# Altium schematic sheet Top.SchDoc
size A4; SheetNumber: 1; SheetTotal: 6
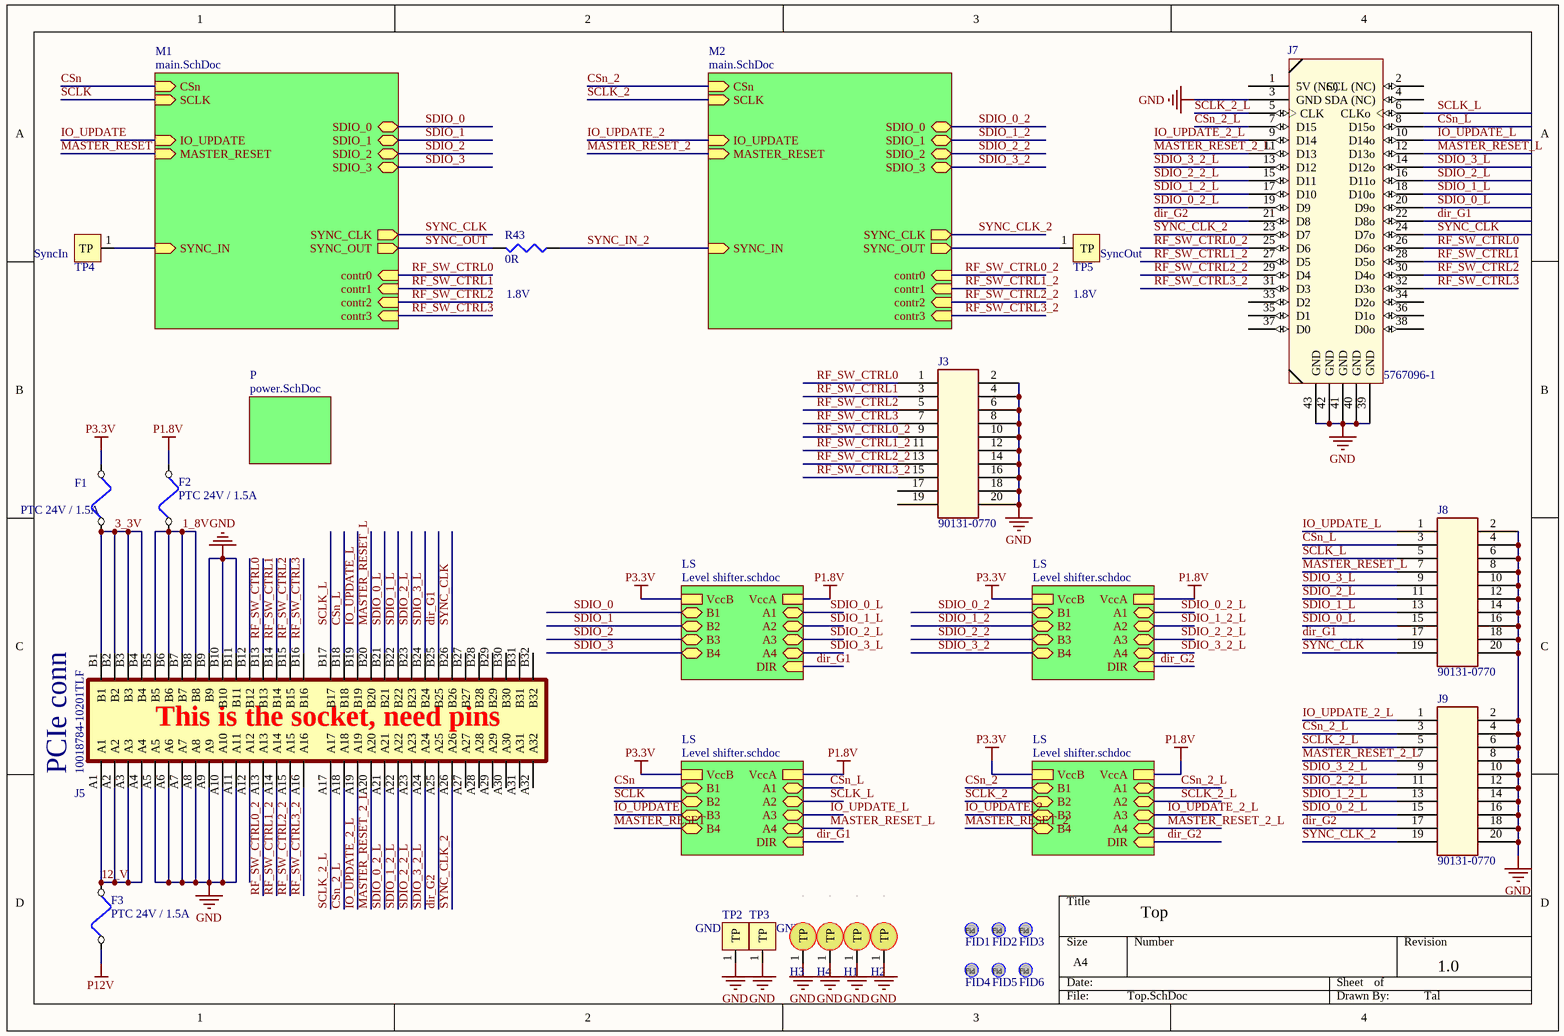
[diagram p0: Top.SchDoc]

## Parts
F1  PTC 24V / 1.5A  [1812_F]
F2  PTC 24V / 1.5A  [1812_F]
F3  PTC 24V / 1.5A  [1812_F]
FID1  Fiducial  [Fiducial]  (value not drawn)
FID2  Fiducial  [Fiducial]  (value not drawn)
FID3  Fiducial  [Fiducial]  (value not drawn)
FID4  Fiducial  [Fiducial]  (value not drawn)
FID5  Fiducial  [Fiducial]  (value not drawn)
FID6  Fiducial  [Fiducial]  (value not drawn)
H1  Hole 3mm  [hole 3mm]  (value not drawn)
H2  Hole 3mm  [hole 3mm]  (value not drawn)
H3  Hole 3mm  [hole 3mm]  (value not drawn)
H4  Hole 3mm  [hole 3mm]  (value not drawn)
J3  90131-0770  [HEADER_10x2]
J5  10018784-10201TLF  [PCIE_8LANE_EDGE]
J7  5767096-1  [MICTOR-38_PIN]
J8  90131-0770  [HEADER_10x2]
J9  90131-0770  [HEADER_10x2]
R43  0R  [R0402]
TP2  GND  [TP_2x1.8]
TP3  GND  [TP_2x1.8]
TP4  SyncIn  [TP_2x1.8]
TP5  SyncOut  [TP_2x1.8]

## Sub-sheets
LS = Level shifter.schdoc: A4 (bidir), B3 (bidir), A2 (bidir), B1 (bidir), B4 (bidir), A1 (bidir), B2 (bidir), A3 (bidir), VccA, VccB, DIR (in)
LS = Level shifter.schdoc: A4 (bidir), B3 (bidir), A2 (bidir), B1 (bidir), B4 (bidir), A1 (bidir), B2 (bidir), A3 (bidir), VccA, VccB, DIR (in)
LS = Level shifter.schdoc: A4 (bidir), B3 (bidir), A2 (bidir), B1 (bidir), B4 (bidir), A1 (bidir), B2 (bidir), A3 (bidir), VccA, VccB, DIR (in)
LS = Level shifter.schdoc: A4 (bidir), B3 (bidir), A2 (bidir), B1 (bidir), B4 (bidir), A1 (bidir), B2 (bidir), A3 (bidir), VccA, VccB, DIR (in)
M1 = main.SchDoc: SYNC_CLK (out), SYNC_OUT (out), SDIO_0 (bidir), SDIO_1 (bidir), SDIO_2 (bidir), SDIO_3 (bidir), CSn (in), IO_UPDATE (in), MASTER_RESET (in), SCLK (in), SYNC_IN (in), contr0 (in), contr1 (in), contr2 (in), contr3 (in)
M2 = main.SchDoc: SYNC_CLK (out), SYNC_OUT (out), SDIO_0 (bidir), SDIO_1 (bidir), SDIO_2 (bidir), SDIO_3 (bidir), CSn (in), IO_UPDATE (in), MASTER_RESET (in), SCLK (in), SYNC_IN (in), contr0 (in), contr1 (in), contr2 (in), contr3 (in)
P = power.SchDoc: no entries

## Nets
GND: H1.1(TP) H2.1(TP) H3.1(TP) H4.1(TP) J3.2 J3.4 J3.6 J3.8 J3.10 J3.12 J3.14 J3.16 J3.18 J3.20 J5.A5 J5.A6 J5.A7 J5.A8 J5.A9 J5.A10 J5.A11 J5.B9 J5.B10 J5.B11 J7.3(GND) J7.39(GND) J7.40(GND) J7.41(GND) J7.42(GND) J7.43(GND) J8.2 J8.4 J8.6 J8.8 J8.10 J8.12 J8.14 J8.16 J8.18 J8.20 J9.2 J9.4 J9.6 J9.8 J9.10 J9.12 J9.14 J9.16 J9.18 J9.20 TP2.1(TP) TP3.1(TP)
P1.8V: F2.2 ; sheet LS/VccA, sheet LS/VccA, sheet LS/VccA, sheet LS/VccA
P3.3V: F1.2 ; sheet LS/VccB, sheet LS/VccB, sheet LS/VccB, sheet LS/VccB
P12V: F3.1
1_8V: F2.1 J5.B5 J5.B6 J5.B7 J5.B8
3_3V: F1.1 J5.B1 J5.B2 J5.B3 J5.B4
12_V: F3.2 J5.A1 J5.A2 J5.A3 J5.A4
CSn: sheet M1/CSn, sheet LS/B1
CSn_2: sheet M2/CSn, sheet LS/B1
CSn_2_L: J5.A18 J7.7(D15) J9.3 ; sheet LS/A1
CSn_L: J5.B18 J7.8(D15o) J8.3 ; sheet LS/A1
dir_G1: J5.B25 J7.22(D8o) J8.17 ; sheet LS/DIR, sheet LS/DIR
dir_G2: J5.A25 J7.21(D8) J9.17 ; sheet LS/DIR, sheet LS/DIR
IO_UPDATE: sheet M1/IO_UPDATE, sheet LS/B3
IO_UPDATE_2: sheet M2/IO_UPDATE, sheet LS/B3
IO_UPDATE_2_L: J5.A19 J7.9(D14) J9.1 ; sheet LS/A3
IO_UPDATE_L: J5.B19 J7.10(D14o) J8.1 ; sheet LS/A3
MASTER_RESET: sheet M1/MASTER_RESET, sheet LS/B4
MASTER_RESET_2: sheet M2/MASTER_RESET, sheet LS/B4
MASTER_RESET_2_L: J5.A20 J7.11(D13) J9.7 ; sheet LS/A4
MASTER_RESET_L: J5.B20 J7.12(D13o) J8.7 ; sheet LS/A4
RF_SW_CTRL0: J3.1 J5.B13 J7.26(D6o) ; sheet M1/contr0
RF_SW_CTRL0_2: J3.9 J5.A13 J7.25(D6) ; sheet M2/contr0
RF_SW_CTRL1: J3.3 J5.B14 J7.28(D5o) ; sheet M1/contr1
RF_SW_CTRL1_2: J3.11 J5.A14 J7.27(D5) ; sheet M2/contr1
RF_SW_CTRL2: J3.5 J5.B15 J7.30(D4o) ; sheet M1/contr2
RF_SW_CTRL2_2: J3.13 J5.A15 J7.29(D4) ; sheet M2/contr2
RF_SW_CTRL3: J3.7 J5.B16 J7.32(D3o) ; sheet M1/contr3
RF_SW_CTRL3_2: J3.15 J5.A16 J7.31(D3) ; sheet M2/contr3
SCLK: sheet M1/SCLK, sheet LS/B2
SCLK_2: sheet M2/SCLK, sheet LS/B2
SCLK_2_L: J5.A17 J7.5(CLK) J9.5 ; sheet LS/A2
SCLK_L: J5.B17 J7.6(CLKo) J8.5 ; sheet LS/A2
SDIO_0: sheet M1/SDIO_0, sheet LS/B1
SDIO_0_2: sheet M2/SDIO_0, sheet LS/B1
SDIO_0_2_L: J5.A21 J7.19(D9) J9.15 ; sheet LS/A1
SDIO_0_L: J5.B21 J7.20(D9o) J8.15 ; sheet LS/A1
SDIO_1: sheet M1/SDIO_1, sheet LS/B2
SDIO_1_2: sheet M2/SDIO_1, sheet LS/B2
SDIO_1_2_L: J5.A22 J7.17(D10) J9.13 ; sheet LS/A2
SDIO_1_L: J5.B22 J7.18(D10o) J8.13 ; sheet LS/A2
SDIO_2: sheet M1/SDIO_2, sheet LS/B3
SDIO_2_2: sheet M2/SDIO_2, sheet LS/B3
SDIO_2_2_L: J5.A23 J7.15(D11) J9.11 ; sheet LS/A3
SDIO_2_L: J5.B23 J7.16(D11o) J8.11 ; sheet LS/A3
SDIO_3: sheet M1/SDIO_3, sheet LS/B4
SDIO_3_2: sheet M2/SDIO_3, sheet LS/B4
SDIO_3_2_L: J5.A24 J7.13(D12) J9.9 ; sheet LS/A4
SDIO_3_L: J5.B24 J7.14(D12o) J8.9 ; sheet LS/A4
SYNC_CLK: J5.B26 J7.24(D7o) J8.19 ; sheet M1/SYNC_CLK
SYNC_CLK_2: J5.A26 J7.23(D7) J9.19 ; sheet M2/SYNC_CLK
SYNC_IN_2: R43.1 ; sheet M2/SYNC_IN
SYNC_OUT: R43.2 ; sheet M1/SYNC_OUT
NetTP4_1: TP4.1(TP) ; sheet M1/SYNC_IN
NetTP5_1: TP5.1(TP) ; sheet M2/SYNC_OUT

Not connected (* = marked no-connect by the designer): J3 17 19; J5 A12 A27 A28 A29 A30 A31 A32 B12 B27 B28 B29 B30 B31 B32; J7 1(5V_(NC)) 2(SCL_(NC)) 4(SDA_(NC)) 33(D2) 34(D2o) 35(D1) 36(D1o) 37(D0) 38(D0o)

## Notes on the sheet
- (near R43) 1.8V
- (near TP5) 1.8V
- (near J5) PCIe conn
- (near J5) This is the socket, need pins
- Top
- 1.0
- Tal
- (in symbol Fiducial) Fid

## Library data of the parts
F1-F3 = 1812L150/24MR: FUSE PTC 24V 1.5A POLYFUSE 1812; Manufacturer: Littelfuse Inc; LANDA P/N: EFS-000011; Package / Case: 1812 (4532 Metric), Concave; RoHS: RoHS Compliant; Manufacturer Part Number: 1812L150/24MR; ComponentLink1URL: http://www.littelfuse.com/data/en/Data_Sheets/Littelfuse_PTC_1812L.pdf; ComponentLink1Description: http://www.littelfuse.com/data/en/Data_Sheets/Littelfuse_PTC_1812L.pdf; Current - Hold (Ih) (Max): 1.5A
FID1-FID6 = Fiducial: Assembly: NA
J3 J8 J9 = 90131-0770: CONN HEADER 20 TH; Manufacturer: Molex Connector Corporation; LANDA P/N: ECN-000005; RoHS: RoHS Compliant; Mounting Type: Through Hole; Contact Type: Male Pin; ComponentLink1URL: http://www.molex.com/pdm_docs/sd/901310770_sd.pdf; ComponentLink1Description: http://www.molex.com/pdm_docs/sd/901310770_sd.pdf; Manufacturer Part Number: 90131-0770
J5 = 10018784-10201TLF: 64 Position Female Connector PCI Expressâ„¢ Gold 0.039 _1.00mm_ Black; MF: Amphenol ICC; Price: None; Value: *; MP: 10018784-10201TLF; Package: None; SnapEDA_Link: https://www.snapeda.com/parts/10018784-10201TLF/Amphenol%20FCI/view-part/2598016/?ref=snap; Availability: Unavailable
J7 = 5767096-1: CONN MICTOR 38POS .025 VERT SMD; Manufacturer: TE Connectivity; LANDA P/N: ECN-000060; RoHS: RoHS Compliant; ComponentLink1URL: http://www.te.com/commerce/DocumentDelivery/DDEController?Action=srchrtrv&DocNm=5767096&DocType=Customer+Drawing&DocLang=English; ComponentLink1Description: http://www.te.com/commerce/DocumentDelivery/DDEController?Action=srchrtrv&DocNm=5767096&DocType=Customer+Drawing&DocLang=English; Manufacturer Part Number: 5767096-1
R43 = RES 100 OHM 1/10W 1% 0402 SMD: RES 0 OHM 1/10W 1% 0402 SMD; Manufacturer Part Number: ERJ-2RKF1000X; Manufacturer: Panasonic Electronic Components; LANDA P/N: ERS-000079; Assembly: N.C; Package / Case: 0402 (1005 Metric); RoHS: RoHS Compliant; ComponentLink1URL: http://industrial.panasonic.com/www-cgi/jvcr13pz.cgi?E+PZ+3+AOA0002+ERJ2RKF1000X+7+WW; ComponentLink1Description: http://industrial.panasonic.com/www-cgi/jvcr13pz.cgi?E+PZ+3+AOA0002+ERJ2RKF1000X+7+WW; Supplier Device Package: 0402
TP2 TP4 TP5 = TP mini_2: TP PC MINIATURE SMT; Manufacturer: Keystone Electronics; Manufacturer Part Number: 5015; Assembly: N.A; LANDA P/N: ECN-000032; RoHS: RoHS Compliant
TP3 = TP mini_1: TP PC MINIATURE SMT; Manufacturer: Keystone Electronics; Manufacturer Part Number: 5015; Assembly: N.A; LANDA P/N: ECN-000032; RoHS: RoHS Compliant